# EAGLE design Grove - I2C Motor Driver (EAGLE 6.1)
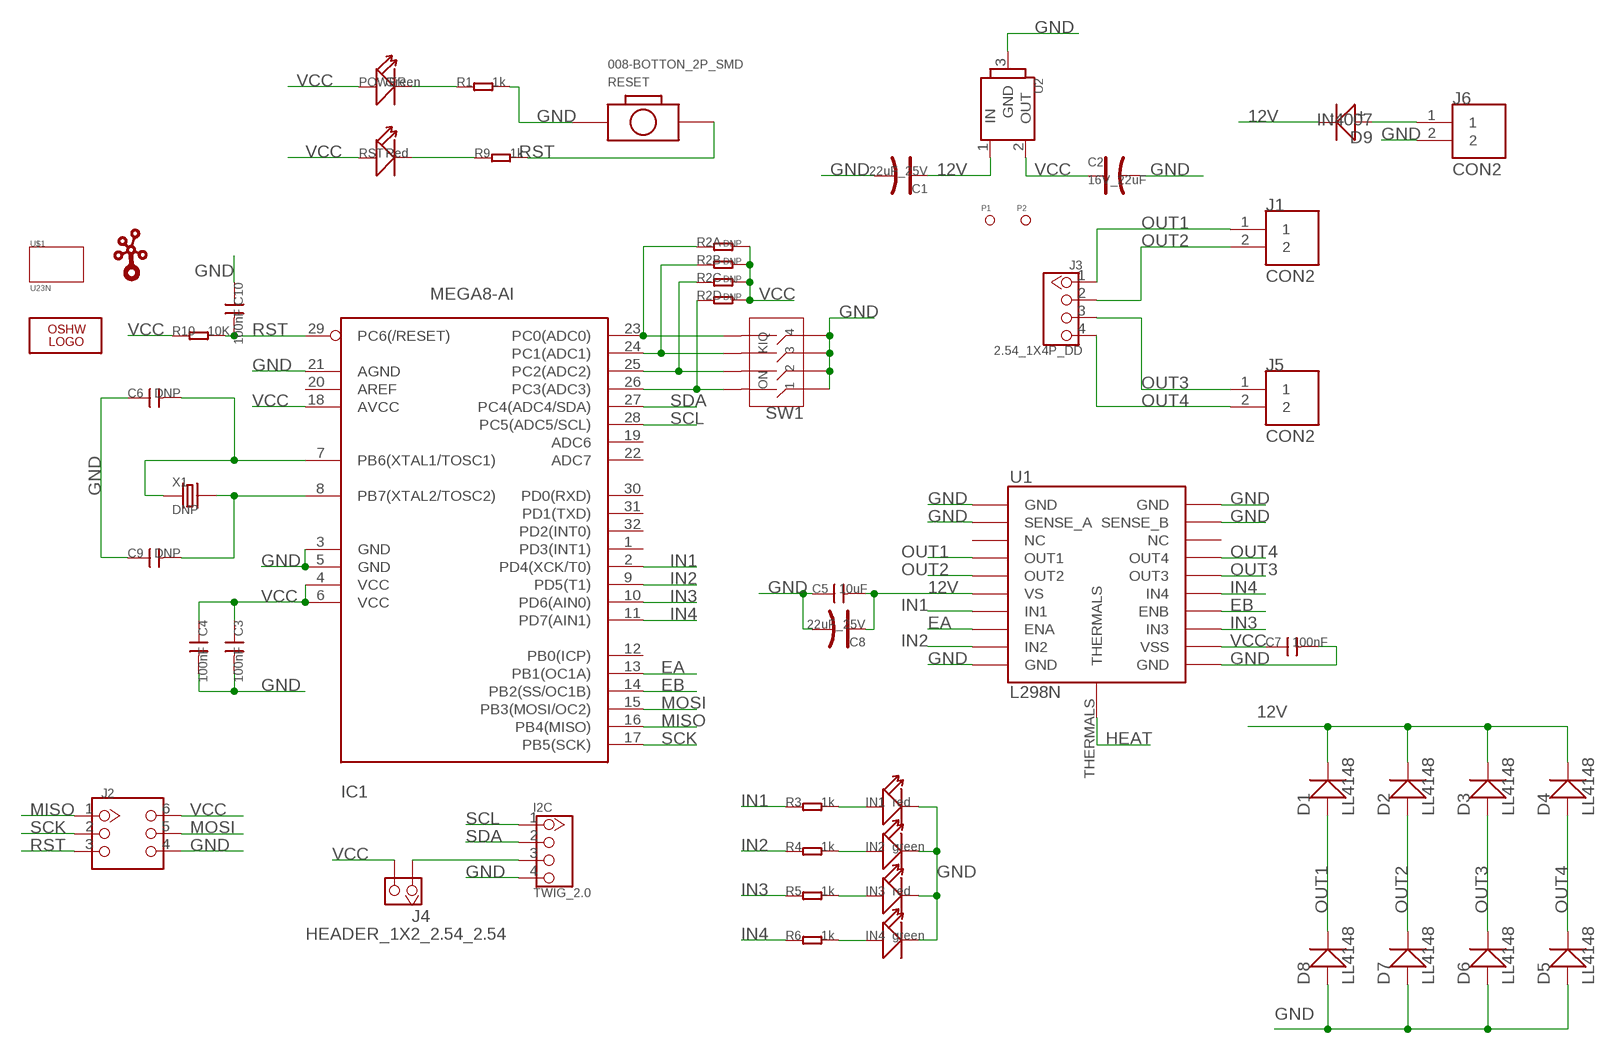
[diagram p0: schematic, sheet 1]

## Parts
C1  22uF_25V  CAP-AVX-C  [AVX-C]
C2  16V_22uF  CAP-AVX-B  [AVX-B]
C3  100nF  C-0603  [0603]
C4  100nF  C-0603  [0603]
C5  10uF  C-0805  [0805]
C6  DNP  006-C30*35  [0603_S]
C7  100nF  C-0603  [0603]
C8  22uF_25V  CAP-AVX-C  [AVX-C]
C9  DNP  006-C30*35  [0603_S]
C10  100nF  006-C30*35  [0603_S]
D1  LL4148  D'1206'  [SOD123]
D2  LL4148  D'1206'  [SOD123]
D3  LL4148  D'1206'  [SOD123]
D4  LL4148  D'1206'  [SOD123]
D5  LL4148  D'1206'  [SOD123]
D6  LL4148  D'1206'  [SOD123]
D7  LL4148  D'1206'  [SOD123]
D8  LL4148  D'1206'  [SOD123]
D9  IN4007  010-D2010  [D2010@1]
I2C  TWIG_2.0  [2.0_1X4]
IC1  MEGA8-AI  [TQFP32-08]
IN1  red  007-LED0603  [D0603]
IN2  green  007-LED0603  [D0603]
IN3  red  007-LED0603  [D0603]
IN4  green  007-LED0603  [D0603]
J1  CON2  [CON2]
J2  HEADER-2X3P-60/35MIL  [2X3P-2.54-65/35MIL]
J3  2.54_1X4P_DD  [CK_1X4]
J4  HEADER_1X2_2.54_2.54  [65*35]
J5  CON2  [CON2]
J6  CON2  [CON2]
LOGO2  LOGO-OSHW-FILLX0200-NT  [OSHW_FILLX200_NOTEXT]
P1  PAD-MARK  [ROUND-MARK-1.0]
P2  PAD-MARK  [ROUND-MARK-1.0]
POWER  Green  007-LED0603  [D0603]
R1  1k  005-R0603  [0603-1]
R2  DNP  R-4R-1206  [1206-8-3.3X2.4]
R3  1k  005-R0603  [0603-1]
R4  1k  005-R0603  [0603-1]
R5  1k  005-R0603  [0603-1]
R6  1k  005-R0603  [0603-1]
R9  1k  005-R0603  [0603-1]
R10  10K  005-R0603  [0603-1]
RESET  008-BOTTON_2P_SMD  [BOTTON_1]
RST  Red  007-LED0603  [D0603]
SW1  SWITCH-KM-04'KM-04'  [8P-SMD-11.8X6.8X3.3H]
U1  L298N  L298_BRIDGE_DRIVER  [POWERSO20]
U2  78M05-TO252  [TO252]
U$1  U23N  [U2*3N]
U$3  TWIGLOGOTWIGLOGO_SMALL  [TWIGLOGO_SMALL]
X1  DNP  CRYSTAL-5032  [2P-SMD-5X3.2]

## Nets
12V: C1.+ C5.2 C8.+ D1.- D2.- D3.- D4.- D9.- U1.P$6(VS) U2.1(IN)
EA: IC1.13(PB1(OC1A)) U1.P$8(ENA)
EB: IC1.14(PB2(SS/OC1B)) U1.P$14(ENB)
GND: C1.- C2.- C3.2 C4.2 C5.1 C6.1 C7.2 C8.- C9.1 C10.1 D5.+ D6.+ D7.+ D8.+ I2C.4 IC1.3(GND) IC1.5(GND) IC1.21(AGND) IN1.- IN2.- IN3.- IN4.- J2.4 J6.2 R1.2 RESET.1 SW1.1 SW1.2 SW1.3 SW1.4 U1.P$1(GND) U1.P$2(SENSE_A) U1.P$10(GND) U1.P$11(GND) U1.P$19(SENSE_B) U1.P$20(GND) U2.3(GND)
HEAT: U1.THERMALS
IN1: IC1.2(PD4(XCK/T0)) R3.1 U1.P$7(IN1)
IN2: IC1.9(PD5(T1)) R4.1 U1.P$9(IN2)
IN3: IC1.10(PD6(AIN0)) R5.1 U1.P$13(IN3)
IN4: IC1.11(PD7(AIN1)) R6.1 U1.P$15(IN4)
MISO: IC1.16(PB4(MISO)) J2.1
MOSI: IC1.15(PB3(MOSI/OC2)) J2.5
N$1: IN3.+ R5.2
N$2: I2C.3 J4.1
N$3: POWER.- R1.1
N$4: IC1.23(PC0(ADC0)) R2.1 SW1.5
N$5: IC1.24(PC1(ADC1)) R2.2 SW1.6
N$7: IC1.25(PC2(ADC2)) R2.3 SW1.7
N$8: C6.2 IC1.7(PB6(XTAL1/TOSC1)) X1.1
N$9: C9.2 IC1.8(PB7(XTAL2/TOSC2)) X1.2
N$10: R9.1 RST.-
N$11: IC1.26(PC3(ADC3)) R2.4 SW1.8
N$12: D9.+ J6.1
N$14: IN1.+ R3.2
N$15: IN2.+ R4.2
N$17: IN4.+ R6.2
OUT1: D1.+ D8.- J1.1 J3.1 U1.P$4(OUT1)
OUT2: D2.+ D7.- J1.2 J3.2 U1.P$5(OUT2)
OUT3: D3.+ D6.- J3.3 J5.1 U1.P$16(OUT3)
OUT4: D4.+ D5.- J3.4 J5.2 U1.P$17(OUT4)
RST: C10.2 IC1.29(PC6(/RESET)) J2.3 R9.2 R10.2 RESET.P$2
SCK: IC1.17(PB5(SCK)) J2.2
SCL: I2C.1 IC1.28(PC5(ADC5/SCL))
SDA: I2C.2 IC1.27(PC4(ADC4/SDA))
VCC: C2.+ C3.1 C4.1 C7.1 IC1.4(VCC) IC1.6(VCC) IC1.18(AVCC) J2.6 J4.2 POWER.+ R2.5 R2.6 R2.7 R2.8 R10.1 RST.+ U1.P$12(VSS) U2.2(OUT)
Unconnected: IC1.1(PD3(INT1)) IC1.12(PB0(ICP)) IC1.19(ADC6) IC1.20(AREF) IC1.22(ADC7) IC1.30(PD0(RXD)) IC1.31(PD1(TXD)) IC1.32(PD2(INT0)) U1.P$3(NC) U1.P$18(NC)

## Library data of the parts
C1 C2 C8 = Discrete:CAP*: Electrolytic Capacitors,Tantalum Capacitors and Super Capacitors
C3-C5 C7 = Discrete:C*: Ceramic Capacitors
C6 C9 C10 = Discrete:006-C*: Ceramic Capacitors
D1-D8 = Discrete:D*
D9 = Discrete:010-D*
I2C = CONNECTER:TWIG_2.0
IC1 = IC:MEGA8: MICROCONTROLLER 8 Kbytes FLASH 1 kbytes SRAM 512 bytes EEPROM USART 6-channel 10 bit ADC 2-channel 8 bit ADC
IN1-IN4 POWER RST = Discrete:007-LED*
J1 J5 J6 = 2pin:CON2
J2 = Connector:HEADER-2X3P
J3 = Connector:2.54_1X4P
J4 = Connector:HEADER_1X2_2.54
LOGO2 = Logo:LOGO-OSHW-FILL
P1 P2 = Discrete:PAD-MARK; PARTNO: DNP
R1 R3-R6 R9 R10 = Discrete:005-R*
R2 = Discrete:R-4R*: Resistor Array
RESET = Discrete:008-BOTTON_2P
SW1 = Discrete:SWITCH-KM-04
U1 = ICs:L298_BRIDGE_DRIVER
U2 = IC:78M05: 0.5A Three Terminal Positive Voltage Regulators http://pdf1.alldatasheet.com/datasheet-pdf/view/31368/TOSHIBA/78M05/+21_79UPLRhpDDdCDytD+/datasheet.pdf
U$1 = twig_template1:U2*3N
U$3 = seeedleo:TWIGLOGO
X1 = Discrete:CRYSTAL*: CRYSTAL

## Board
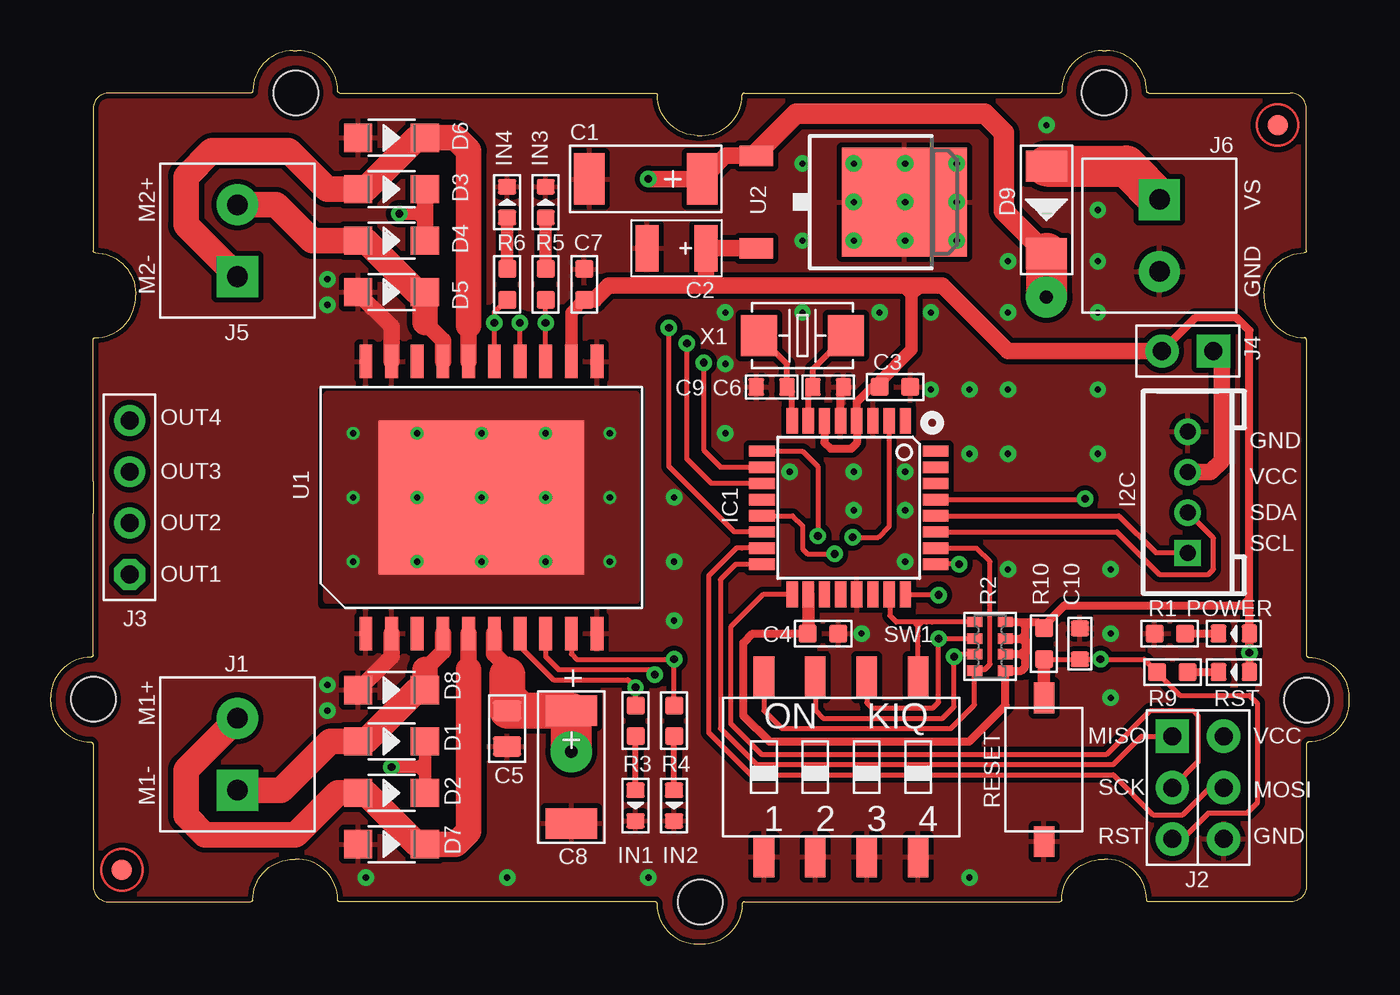
[diagram p1: board, top side]
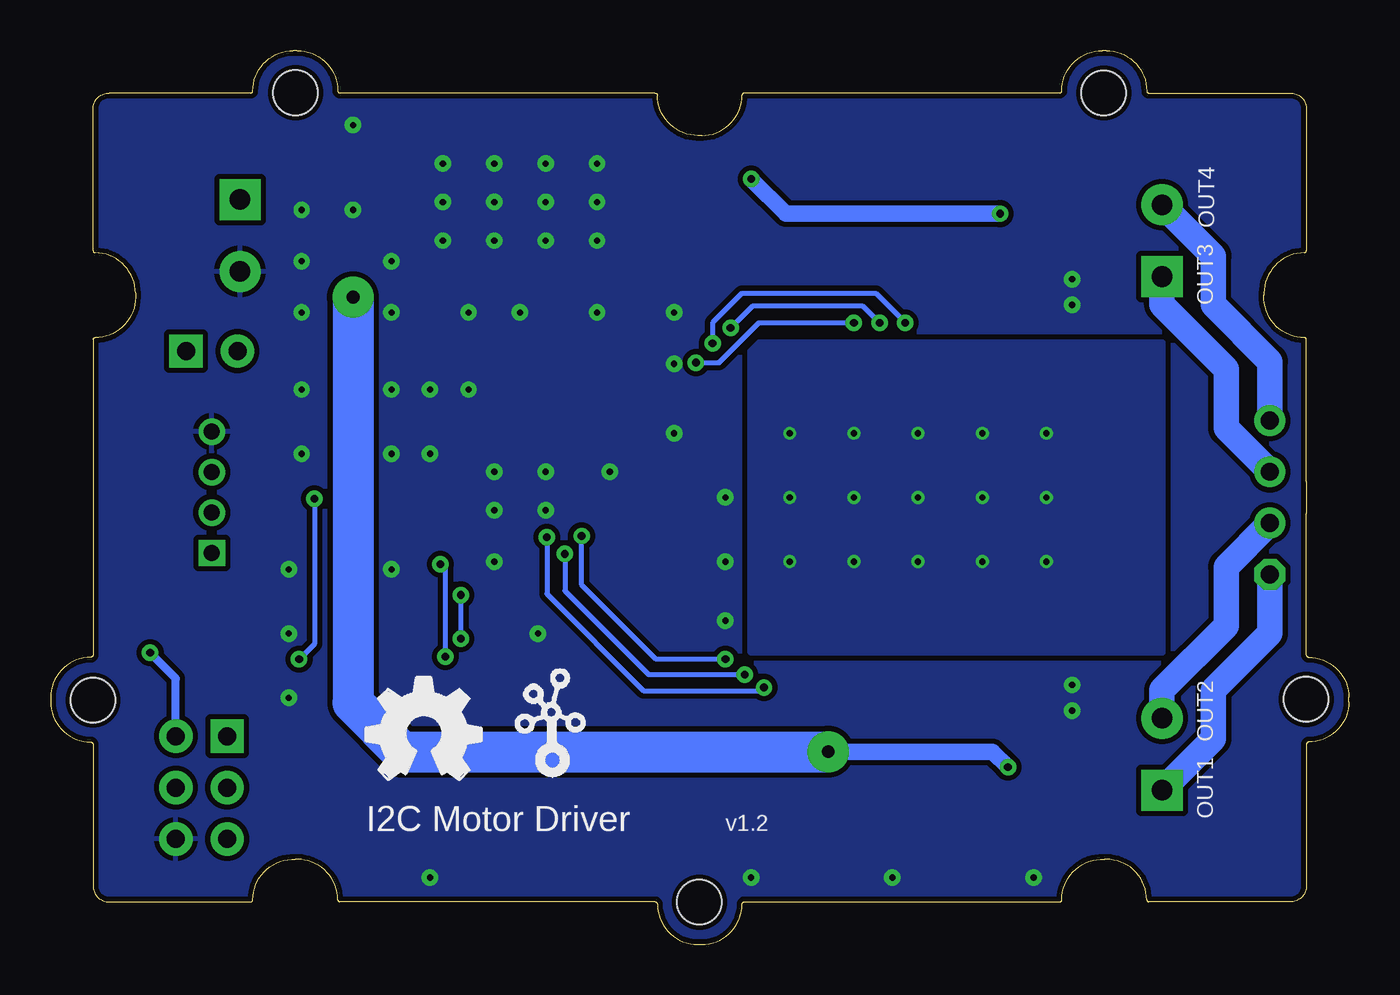
[diagram p2: board, bottom side, seen from below]

Size 64.2 x 44.2 mm. Coordinates in mm from the lower left corner, seen from the top.
Copper layers (1*16): Top 0.035mm / dielectric 1.5mm / Bottom 0.035mm
Design rules: minimum track width 6mil, minimum drill 12mil, track to track 6mil, track to pad 6mil, pad to pad 6mil, via to via 6mil, smd to smd 0mil, copper to edge 10mil, drill to drill 10mil, minimum pad ring 10mil, minimum via ring 6mil, stop-mask expansion 2mil, vias tented up to drill 25mil, thermal gap 10mil
tRestrict: area 16.1,28.5 to 16.3,29.2; area 16.1,15 to 16.3,15.7

### Footprints (pad centres in the part's own frame; a part is rotated, then mirrored left to right if it is on the bottom)
AVX-C = smd 1.524 x 2.54: + -2.794,0; - 2.794,0
AVX-B = smd 1.143 x 2.286: + -1.46,0; - 1.46,0
0603 = smd 0.889 x 0.889: 1 -0.762,0; 2 0.762,0
0805 = smd 1.016 x 1.397: 1 -0.889,0; 2 0.889,0
0603_S = smd 0.762 x 0.889: 1 -0.762,0; 2 0.762,0
SOD123 = smd 1.397 x 1.397: + -1.651,0; - 1.651,0
D2010@1 = smd 1.524 x 2.032: + -2.159,0; - 2.159,0
2.0_1X4 = drill 0.8 pad 1.27 square: 1 -3,0 | drill 0.8 pad 1.27: 2 -1,0; 3 1,0; 4 3,0
TQFP32-08 = smd 1.27 x 0.559: 1 -4.293,2.8; 2 -4.293,2; 3 -4.293,1.2; 4 -4.293,0.4; 5 -4.293,-0.4; 6 -4.293,-1.2; 7 -4.293,-2; 8 -4.293,-2.8; 17 4.293,-2.8; 18 4.293,-2; 19 4.293,-1.2; 20 4.293,-0.4; 21 4.293,0.4; 22 4.293,1.2; 23 4.293,2; 24 4.293,2.8 | smd 0.559 x 1.27: 9 -2.8,-4.293; 10 -2,-4.293; 11 -1.2,-4.293; 12 -0.4,-4.293; 13 0.4,-4.293; 14 1.2,-4.293; 15 2,-4.293; 16 2.8,-4.293; 25 2.8,4.293; 26 2,4.293; 27 1.2,4.293; 28 0.4,4.293; 29 -0.4,4.293; 30 -1.2,4.293; 31 -2,4.293; 32 -2.8,4.293
D0603 = smd 0.762 x 0.889: + -0.762,0; - 0.762,0
CON2 = drill 1.016 pad 2.032 square: 1 0,1.778 | drill 1.016 pad 2.032: 2 0,-1.778
2X3P-2.54-65/35MIL = drill 0.889 pad 1.651 square: 1 -1.27,2.54 | drill 0.889 pad 1.651: 2 -1.27,0; 3 -1.27,-2.54; 4 1.27,-2.54; 5 1.27,0; 6 1.27,2.54
CK_1X4 = drill 0.889 pad 1.524 octagon: 1 0,3.81 | drill 0.889 pad 1.524: 2 0,1.27; 3 0,-1.27; 4 0,-3.81
65*35 = drill 0.889 pad 1.651 square: 1 0,1.27 | drill 0.889 pad 1.651: 2 0,-1.27
ROUND-MARK-1.0 = smd 1.016 x 1.016: P$1 0,0
0603-1 = smd 0.889 x 0.889: 1 -0.762,0; 2 0.762,0
1206-8-3.3X2.4 = smd 0.508 x 0.762: 1 -1.206,-0.762; 2 -0.381,-0.762; 3 0.381,-0.762; 4 1.206,-0.762; 5 1.206,0.762; 6 0.381,0.762; 7 -0.381,0.762; 8 -1.206,0.762
BOTTON_1 = smd 1.524 x 1.016: 1 -3.556,0; P$2 3.556,0
8P-SMD-11.8X6.8X3.3H = smd 1.016 x 2.032: 1 -3.81,-4.445; 2 -1.27,-4.445; 3 1.27,-4.445; 4 3.81,-4.445; 5 3.81,4.445; 6 1.27,4.445; 7 -1.27,4.445; 8 -3.81,4.445
POWERSO20 = smd 1.651 x 0.635: P$1 -6.731,5.715; P$2 -6.731,4.445; P$3 -6.731,3.175; P$4 -6.731,1.905; P$5 -6.731,0.635; P$6 -6.731,-0.635; P$7 -6.731,-1.905; P$8 -6.731,-3.175; P$9 -6.731,-4.445; P$10 -6.731,-5.715; P$11 6.731,-5.715; P$12 6.731,-4.445; P$13 6.731,-3.175; P$14 6.731,-1.905; P$15 6.731,-0.635; P$16 6.731,0.635; P$17 6.731,1.905; P$18 6.731,3.175; P$19 6.731,4.445; P$20 6.731,5.715 | smd 7.62 x 10.16: THERMALS 0,0
TO252 = smd 1.016 x 1.651: 1 -2.286,-4.826; 2 2.286,-4.826 | smd 5.4 x 6.2: 3 0,2.5
U2*3N = hole 2.2: -0.017,20.015; -30.005,10.02; 29.985,9.983; 19.98,-20.005; -19.983,-20.015
2P-SMD-5X3.2 = smd 1.778 x 2.032: 1 -2.159,0; 2 2.159,0

### Placement (x,y rotation side)
C1  29.43,37.85 180 top
C2  30.96,34.42 180 top
C3  41.75,27.56 0 top
C4  38.2,15.37 0 top
C5  22.58,10.67 90 top
C6  38.45,27.56 180 top
C7  26.39,32.64 90 top
C8  25.75,8.77 270 top
C9  35.66,27.56 0 top
C10  50.9,14.86 270 top
D1  16.86,10.04 0 top
D2  16.86,7.5 0 top
D3  16.86,37.34 0 top
D4  16.86,34.8 0 top
D5  16.86,32.26 0 top
D6  16.86,39.88 0 top
D7  16.86,4.96 0 top
D8  16.86,12.58 0 top
D9  49.25,36.32 270 top
I2C  56.23,22.35 90 top
IC1  39.47,21.59 270 top
IN1  28.93,6.86 270 top
IN2  30.83,6.86 270 top
IN3  24.48,36.7 90 top
IN4  22.58,36.7 90 top
J1  9.24,9.4 180 top
J2  56.74,7.75 0 top
J3  3.91,22.1 180 top
J4  56.23,29.34 270 top
J5  9.24,34.8 180 top
J6  54.83,35.05 0 top
LOGO2  48.58,8.14 0 bottom
P1  3.53,3.69 0 top
P2  60.67,40.52 0 top
POWER  58.52,15.37 180 top
R1  55.34,15.37 180 top
R2  46.45,14.73 270 top
R3  28.93,11.05 270 top
R4  30.83,11.05 270 top
R5  24.48,32.64 90 top
R6  22.58,32.64 90 top
R9  55.47,13.46 180 top
R10  49.12,14.86 270 top
RESET  49.12,8.64 90 top
RST  58.52,13.46 180 top
SW1  39.09,8.77 0 top
U1  21.3,22.1 90 top
U2  39.72,36.7 270 top
U$1  32.1,22.1 180 top
U$3  41.62,8.13 0 bottom
X1  37.18,30.1 180 top

### Tracks (layer width: path | path; a pad name or v marks a point on that pad's centre or on a via)
12V  (via drill 0.38 pad 0.81, 0.64 pad 2.03)
  Top 0.61: v17.24,36.13 18.13,36.13 | 18.13,36.13 18.51,36.13 18.51,36.52 18.45,36.58 18.45,36.45 18.13,36.13 | 18.13,36.13 18.45,35.82 | D1.- 18.51,9.02 | 18.51,9.02 18.51,8.77 | 18.51,8.77 18.51,8.45 | 18.51,8.45 D2.- | v16.86,8.77 18.19,8.77 | 18.26,8.77 18.51,8.77 | 18.19,8.77 18.26,8.77 | 18.26,8.77 18.51,9.02 | 18.19,8.77 18.51,8.45
  Top 0.813: U1.P$6 21.94,14.35 22.58,13.72 22.58,13.34 | D3.- 18.51,36.13 D4.- | v29.56,37.85 C1.+ 33.37,38.99 U2.1
  Top 1.016: D9.- 47.15,36.26 47.15,40.13 46.2,41.09 36.86,41.09 34.89,39.12 U2.1
  Top 1.778: 23.27,11.56 C5.2 22.58,13.34 | 23.27,11.56 C8.+ 25.75,11.31 | 23.27,11.56 22.64,12.19
  Top 2.032: D9.- v49.25,32.01 | v25.75,9.53 25.75,11.31
  Bottom 0.813: v17.24,36.13 27.85,36.13 v29.56,37.85 | v25.75,9.53 17.62,9.53 v16.86,8.77
  Bottom 2.032: v25.75,9.53 46.83,9.53 49.25,11.94 v49.25,32.01
EA  (via drill 0.38 pad 0.81)
  Top 0.254: U1.P$8 24.48,14.23 25.12,13.59 29.56,13.59 | 29.56,13.59 29.81,13.34 | IC1.13 36.69,21.19 37.18,20.7 37.18,19.56 37.43,19.31 v38.77,19.31 | 29.56,13.59 29.62,13.59 v29.88,13.34
  Bottom 0.254: v38.77,19.31 38.77,17.48 34.62,13.34 v29.88,13.34
EB  (via drill 0.38 pad 0.81)
  Top 0.254: IC1.14 33.81,20.39 30.58,23.63 v30.58,30.48 | U1.P$14 v23.21,30.74
  Bottom 0.254: v30.58,30.48 29.5,31.56 24.04,31.56 v23.21,30.74
GND  (via drill 0.3 pad 0.81)
  Top 0.406: IC1.5 39.07,27.42 C6.1
  Top 0.813: U1.P$19 16.86,30.55 15.15,32.26 | U1.P$2 16.86,14.23 D8.+
  other vias: 39.72,38.61 42.26,38.61 44.8,38.61 39.72,36.7 42.26,36.7 44.8,36.7 44.8,34.8 42.26,34.8 39.72,34.8 49.25,40.52 49.25,36.32 51.78,36.32 51.78,33.78 51.78,31.24 47.34,31.24 47.34,33.78 43.53,31.24 43.53,27.43 47.34,27.43 45.44,27.43 45.44,24.26 47.34,24.26 51.78,24.26 51.78,27.43 40.99,31.24 33.37,31.24 33.37,28.7 33.37,25.28 39.72,21.46 39.72,23.37 42.26,23.37 42.26,21.46 42.26,18.93 47.34,18.54 52.42,18.54 52.42,15.37 52.42,12.19 37.18,38.61 37.18,36.7 37.18,34.8 40.1,15.37 36.55,23.37 37.18,31.24 15.59,3.3 13.69,12.83 22.58,3.3 29.56,3.3 45.44,3.3 13.69,11.56 30.83,16 30.83,18.93 30.83,22.1 13.69,31.62 13.69,32.9
  pour Bottom: -5.49,44.58 -4.22,44.58 -4.22,43.31 -5.49,43.31
  pour Top (isolate 0.254, rank 6): -0.28,44.33 64.48,44.33 64.48,-0.12 -0.28,-0.12
  pour Bottom (isolate 0.254, rank 6): -0.28,44.33 64.48,44.33 64.48,-0.12 -0.28,-0.12
HEAT  (via drill 0.3 pad 0.64)
  other vias: 21.3,22.1 18.13,22.1 14.96,22.1 24.48,22.1 27.66,22.1 27.66,25.28 24.48,25.28 21.3,25.28 18.13,25.28 14.96,25.28 14.96,18.93 18.13,18.93 21.3,18.93 24.48,18.93 27.66,18.93
  pour Top (isolate 0.406, no thermals): 13.69,27.18 28.93,27.18 28.93,17.02 13.69,17.02
  pour Bottom (isolate 0.406, no thermals): 9.24,29.72 29.56,29.72 29.56,14.48 9.24,14.48
IN1  (via drill 0.38 pad 0.81)
  Top 0.254: U1.P$7 23.21,14.73 24.86,13.08 28.54,13.08 v28.93,12.7 R3.1 | IC1.2 41.47,20.67 40.93,20.13 v39.66,20.13
  Bottom 0.254: v39.66,20.13 39.66,17.33 34.87,12.54 29.09,12.54 v28.93,12.7
IN2  (via drill 0.38 pad 0.81)
  Top 0.254: U1.P$9 25.75,14.35 26,14.1 v30.83,14.1 R4.1 | IC1.9 37.17,24.39 37.94,23.62 v37.94,20.2
  Bottom 0.254: v30.83,14.1 34.26,14.1 37.94,17.78 v37.94,20.2
IN3  (via drill 0.38 pad 0.81)
  Top 0.254: IC1.10 33.15,23.59 32.29,24.45 v32.29,28.77 | U1.P$13 v24.48,30.74 R5.1
  Bottom 0.254: v32.29,28.77 31.15,28.77 29.18,30.74 v24.48,30.74
IN4  (via drill 0.38 pad 0.81)
  Top 0.254: IC1.11 32.68,22.79 31.46,24.01 v31.46,29.72 | U1.P$15 v21.94,30.74 21.94,31.24 R6.1
  Bottom 0.254: v31.46,29.72 31.46,30.74 30.01,32.2 23.4,32.2 v21.94,30.74
MISO
  Top 0.254: IC1.16 33.87,18.79 33.12,18.04 33.12,10.67 34.89,8.89 52.55,8.89 53.94,10.29 J2.1
MOSI
  Top 0.254: 34.16,19.59 IC1.15 33.91,19.59 32.55,18.23 32.55,10.48 34.64,8.38 52.55,8.38 54.52,6.42 55.98,6.42 57.31,7.75 J2.5
N$1
  Top 0.61: R5.2 IN3.+
N$2
  Top 0.813: J4.1 57.91,28.93 57.91,23.9 57.36,23.35 I2C.3
N$3
  Top 0.406: R1.1 POWER.-
N$4
  Top 0.254: SW1.5 42.9,14.73 | 42.9,14.73 42.9,15.24 | R2.1 43.59,15.94 43.31,15.94 | 42.9,14.73 42.9,15.5 | 42.9,15.5 42.9,15.62 | IC1.23 41.5,17.27 41.5,17.02 41.5,16.26 41.82,15.94 43.31,15.94 | 42.9,15.5 42.9,15.75 | 42.9,15.75 43.02,15.88 43.09,15.94 43.31,15.94 | 42.9,15.5 42.9,15.75 | 42.9,15.75 42.77,15.88
N$5  (via drill 0.38 pad 0.81)
  Top 0.254: SW1.6 40.36,11.94 40.61,11.69 43.63,11.69 43.91,11.97 v43.91,15.12 R2.2 | v43.91,17.27 42.29,17.27 IC1.24
  Bottom 0.254: v43.91,15.12 v43.91,17.27
N$7  (via drill 0.38 pad 0.81)
  Top 0.254: SW1.7 37.81,11.56 38.2,11.18 44.11,11.18 44.67,11.75 v44.67,14.23 44.8,14.35 R2.3 | v44.93,18.8 43.78,18.8 43.78,18.79 IC1.25
  Bottom 0.254: v44.67,14.23 44.67,18.54 v44.93,18.8
N$8
  Top 0.305: IC1.7 37.47,27.34 C6.2 37.69,28.45 X1.1
N$9
  Top 0.305: IC1.8 36.67,27.31 C9.2 36.42,28.7 X1.2
N$10
  Top 0.406: R9.1 RST.-
N$11
  Top 0.254: SW1.8 35.27,11.57 36.17,10.67 44.52,10.67 45.69,11.84 R2.4 | R2.4 45.69,13.59 | R2.4 45.69,13.59 | 45.69,13.59 46.2,13.59 46.45,13.85 46.45,18.93 45.82,19.56 45.78,19.59 IC1.26
N$12
  Top 2.032: D9.+ 53.18,38.48 J6.1
N$14
  Top 0.305: IN1.+ 28.93,10.04 R3.2
N$15
  Top 0.305: IN2.+ R4.2
N$17
  Top 0.61: R6.2 IN4.+
OUT1
  Top 0.813: U1.P$4 19.4,14.48 18.51,13.59
  Top 1.27: 18.51,13.59 D8.- 18.13,12.58 15.59,10.04 D1.+ 13.81,10.04 11.4,7.62 J1.1
  Bottom 1.27: J1.1 6.7,10.16 6.7,12.58 3.91,15.37 J3.1
OUT2
  Top 0.813: U1.P$5 20.67,13.59
  Top 1.27: 20.67,13.59 20.67,5.59 20.04,4.96 D7.- 18.13,4.96 15.59,7.5 D2.+ 14.19,7.5 12.12,5.42 7.63,5.42 6.7,6.35 6.7,8.64 J1.2
  Bottom 1.27: J3.2 6.07,18.67 6.07,15.75 9.24,12.58 J1.2
OUT3
  Top 0.813: U1.P$16 20.67,30.61
  Top 1.27: 20.67,30.61 20.67,39.25 20.04,39.88 D6.- 18.13,39.88 15.59,37.34 D3.+ 13.69,37.34 11.78,39.25 7.97,39.25 6.7,37.98 6.7,35.56 J5.1
  Bottom 1.27: J3.3 6.07,25.53 6.07,28.45 9.24,31.62 J5.1
OUT4
  Top 0.813: U1.P$17 19.4,29.85 18.51,30.74
  Top 1.27: 18.51,30.74 D5.- 18.13,32.26 15.59,34.8 D4.+ 12.92,34.8 11.15,36.58 J5.2
  Bottom 1.27: J5.2 6.7,34.04 6.7,31.62 3.91,28.83 J3.4
RST  (via drill 0.38 pad 0.81)
  Top 0.254: J2.3 55.98,5.21 57.25,6.48 59.15,6.48 59.66,6.99 59.66,11.94 59.28,12.32 55.84,12.32 R9.2 54.07,14.1 v51.91,14.1 | R10.2 C10.2 | C10.2 v51.91,14.1 | IC1.29 51.11,21.99 v51.15,22.04 | v51.91,14.1 C10.2
  Top 0.61: RESET.P$2 R10.2
  Bottom 0.254: v51.15,22.04 51.15,14.86 v51.91,14.1
SCK
  Top 0.254: IC1.17 35.24,17.3 33.62,15.69 33.62,10.92 35.15,9.4 52.23,9.4 54.39,11.56 56.48,11.56 56.74,11.31 56.74,9.02 J2.2
SCL
  Top 0.254: IC1.28 52.82,21.19 54.64,19.37 54.66,19.35 I2C.1
SDA
  Top 0.254: IC1.27 52.73,20.39 54.82,18.3 57.26,18.3 57.5,18.54 57.5,20.09 I2C.2
VCC  (via drill 0.38 pad 0.81)
  Top 0.254: 47.91,15.12 47.98,15.18
  Top 0.305: 48.19,15.94 48.19,15.58 48.17,15.56 48.17,15.69 47.91,15.94 | 48.23,15.43 47.98,15.18 | 47.91,15.12 48.17,14.86 | 48.17,14.61 47.91,14.35 48.17,14.1
  Top 0.406: POWER.+ RST.+ | R2.8 47.91,15.94 48.19,15.94 | 48.19,15.94 48.42,15.94 | 48.42,15.94 48.8,15.94 R10.1 49.12,15.75 50.13,16.77 58.96,16.77 | 48.19,15.94 48.19,15.71 | 48.19,15.12 48.19,14.35 | R2.5 47.99,13.53 48.19,13.73 48.19,14.35 | R2.6 47.91,14.35 48.19,14.35 | R2.7 47.91,15.12 48.19,15.12 | 59.28,16.26 POWER.+ | C4.1 34.72,15.37 34.26,14.91 34.26,11.31 35.54,10.03 45.43,10.03 47.21,11.81 R2.5 | 47.21,13.59 R2.5 | C3.1 40.61,27.56 39.87,26.82 IC1.4 39.87,24.79 39.59,24.51 38.58,24.51 38.27,24.82 IC1.6 | POWER.+ 59.28,16.51 | 59.28,16.51 59.28,16.77 | 59.28,16.77 59.28,30.36 58.64,30.99 56.61,30.99 J4.2 | v59.28,14.42 POWER.+ | 59.02,16.77 59.28,16.77 | 58.96,16.77 59.21,17.02 | 58.96,16.77 59.02,16.77 | 59.02,16.77 59.28,16.51 | 48.19,15.12 48.19,15.71 | 48.19,15.71 48.42,15.94
  Top 0.61: IC1.18 37.47,15.4 C4.1 | C3.1 40.99,27.82 42.58,29.4 42.58,32.26 42.26,32.58 | 42.13,32.58 42.58,32.13 42.96,32.51 | 32.42,32.64 32.55,32.64 32.61,32.7 | U1.P$12 25.75,31.24 C7.1
  Top 0.813: 32.48,32.58 27.85,32.58 27.59,32.58 26.89,31.88 C7.1 | 32.48,32.58 42.13,32.58 42.26,32.58 44.1,32.58 47.34,29.34 J4.2 | 32.48,32.58 32.42,32.64 C2.+ U2.2 | 32.16,32.64 32.42,32.9 32.61,32.7
  Bottom 0.406: J2.6 58.01,13.15 v59.28,14.42

### Text on the board
tPlace: VS | M2+ | GND | M2- | OUT4 | GND | OUT3 | VCC | SDA | OUT2 | SCL | OUT1 | + | M1+ | MISO | VCC | M1- | SCK | MOSI | RST | GND
bPlace: OUT4 | OUT3 | OUT2 | OUT1 | v1.2 | I2C Motor Driver